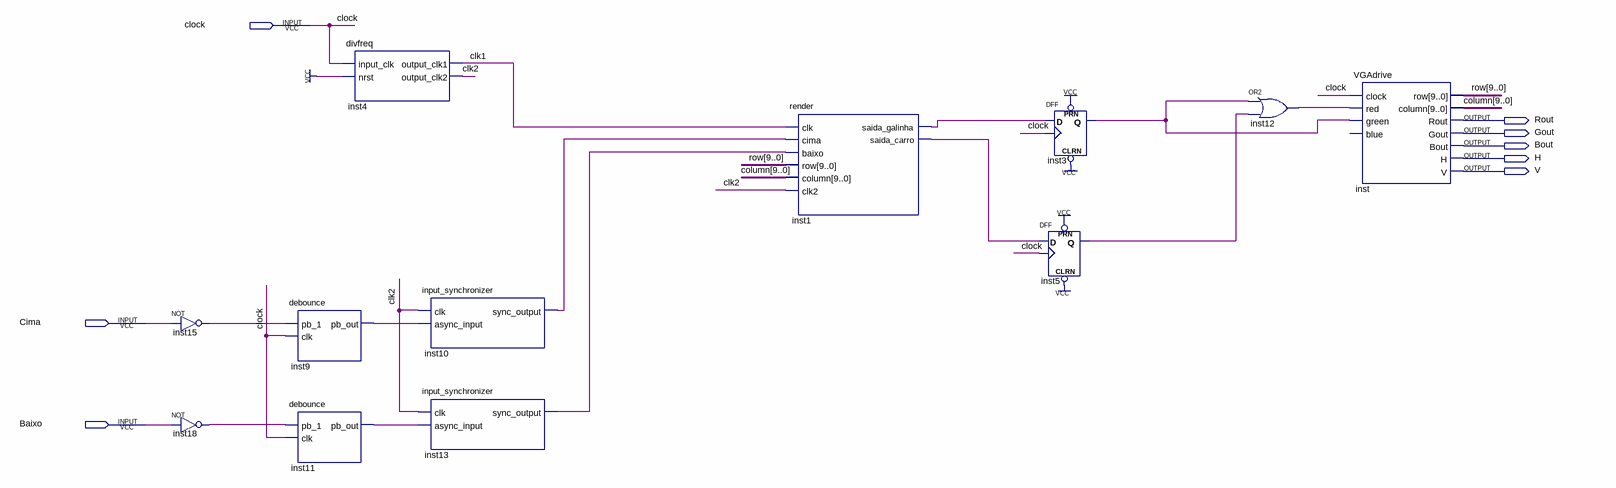
[diagram p0: schematic sheet]
// Quartus schematic freeway.bdf as structural Verilog: 12 symbols, 8 pins
module freeway (
  input  clock,
  input  Cima,
  input  Baixo,
  output Rout,
  output Gout,
  output Bout,
  output H,
  output V
);

  wire clk1, clk2, inst1_saida_carro, inst1_saida_galinha, inst3_q, inst5_q, inst9_pb_out,
       inst10_sync_output, inst11_pb_out, inst12_out, inst13_sync_output, inst15_out, inst18_out;
  wire [9:0] column, row;

  not inst15 (inst15_out, Cima);
  not inst18 (inst18_out, Baixo);
  debounce inst9 (.pb_1(inst15_out), .clk(clock), .pb_out(inst9_pb_out));
  debounce inst11 (.pb_1(inst18_out), .clk(clock), .pb_out(inst11_pb_out));
  divfreq inst4 (.input_clk(clock), .nrst(1'b1), .output_clk1(clk1), .output_clk2(clk2));
  input_synchronizer inst10 (.clk(clk2), .async_input(inst9_pb_out), .sync_output(inst10_sync_output));
  input_synchronizer inst13 (.clk(clk2), .async_input(inst11_pb_out), .sync_output(inst13_sync_output));
  render inst1 (
    .clk(clk1), .cima(inst10_sync_output), .baixo(inst13_sync_output), .row(row), .column(column),
    .clk2(clk2), .saida_galinha(inst1_saida_galinha), .saida_carro(inst1_saida_carro));
  DFF inst3 (.CLRN(1'b1), .CLK(clock), .D(inst1_saida_galinha), .PRN(1'b1), .Q(inst3_q));
  DFF inst5 (.CLRN(1'b1), .CLK(clock), .D(inst1_saida_carro), .PRN(1'b1), .Q(inst5_q));
  or inst12 (inst12_out, inst3_q, inst5_q);
  VGAdrive inst (
    .clock(clock), .red(inst12_out), .green(inst3_q), .row(row), .column(column), .Rout(Rout), .Gout(Gout),
    .Bout(Bout), .H(H), .V(V));  // open: blue
endmodule
